# Altium schematic sheet alarmlight_v1_0.SchDoc: AlarmLight ControlBoard
size A4; DrawnBy: cddxcdx; DocumentNumber: 2018*********; Revision: V1.0; SheetNumber: 1; SheetTotal: 1
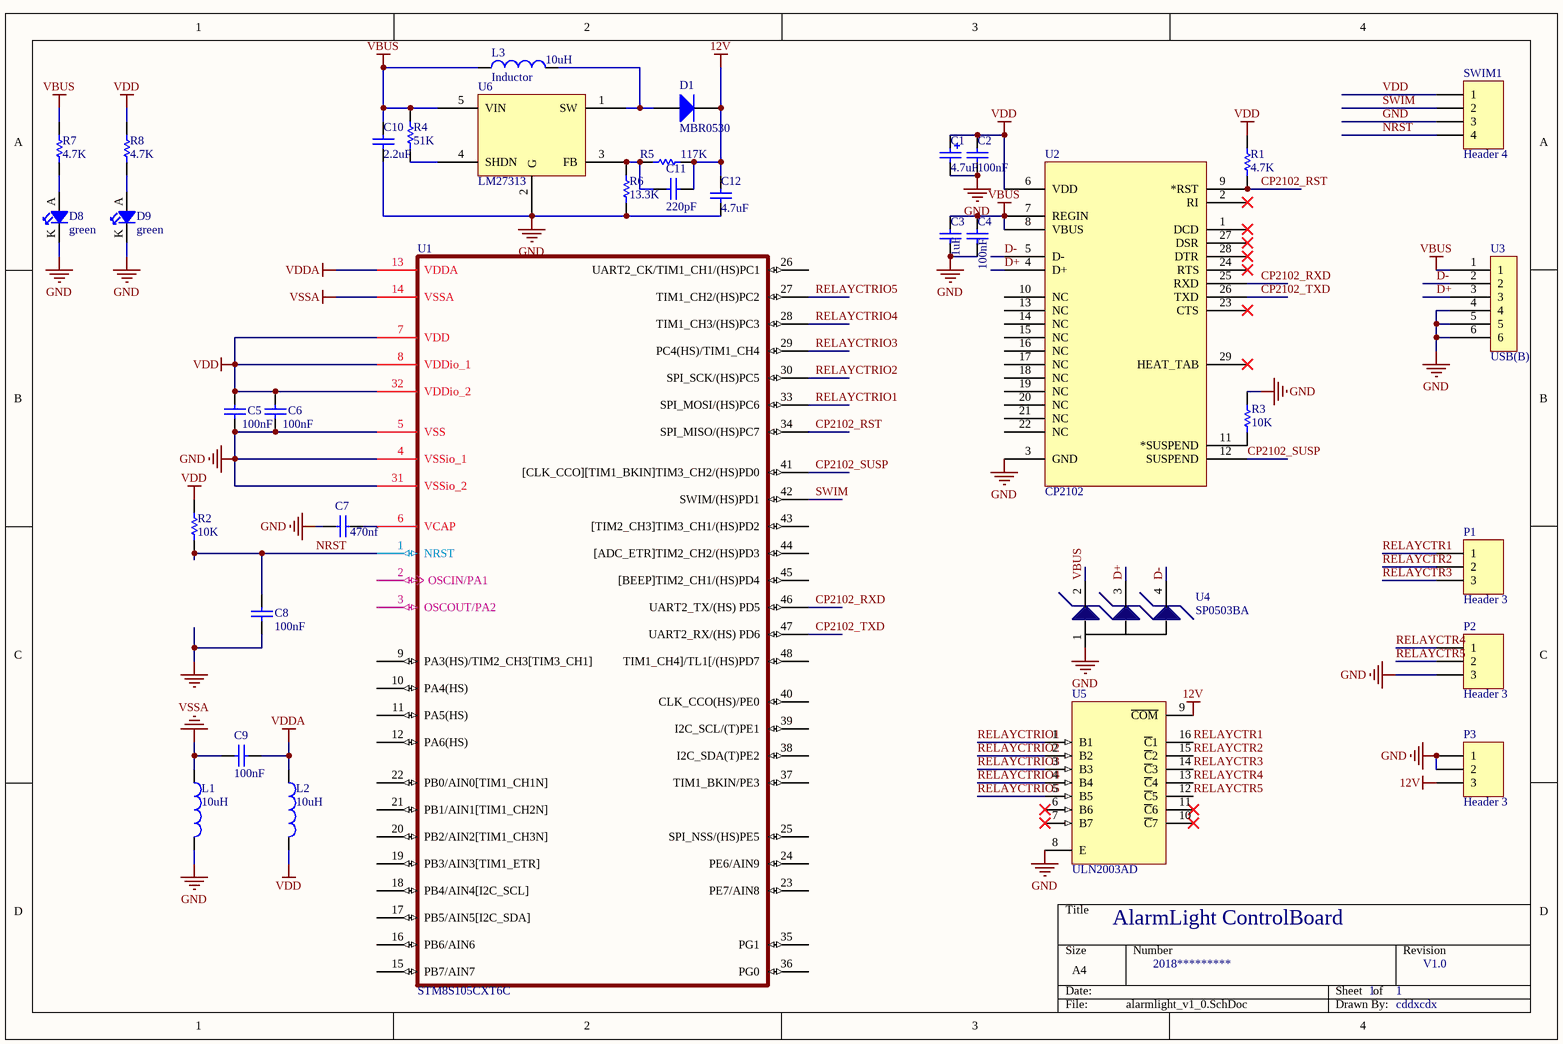
[diagram p0: alarmlight_v1_0.SchDoc]

## Parts
C1  4.7uF  [TC3216]
C2  100nF  [0805C]
C3  1uF  [0805C]
C4  100nF  [0805C]
C5  100nF  [0805C]
C6  100nF  [0805C]
C7  value 470nf  [0805C]  (hidden comment: Cap)
C8  100nF  [0805C]
C9  100nF  [0805C]
C10  2.2uF  [0805C]
C11  220pF  [0805C]
C12  4.7uF  [C-6032]
D1  MBR0530  [SOD_123]
D8  value green  [Diode-LED-0805]  (hidden comment: LED-3mm)
D9  value green  [Diode-LED-0805]  (hidden comment: LED-3mm)
L1  value 10uH  [0805R]  (hidden comment: Inductor)
L2  value 10uH  [0805R]  (hidden comment: Inductor)
L3  Inductor  value 10uH  [SWPA3012]
P1  Header 3  [HDR1X3]
P2  Header 3  [HDR1X3]
P3  Header 3  [HDR1X3]
R1  4.7K  [0805R]
R2  10K  [0805R]
R3  10K  [0805R]
R4  51K  [0805R]
R5  117K  [0805R]
R6  13.3K  [0805R]
R7  4.7K  [0805R]
R8  4.7K  [0805R]
SWIM1  Header 4  [HDR1X4]
U1  STM8S105CXT6C  [LQFP48]
U2  CP2102  [QFN28N5X5-0p5P]
U3  USB(B)  [USB2.5-2H4D]
U4  SP0503BA  [SOT143]
U5  ULN2003AD  [D016_N]
U6  LM27313  [SOT-23-5]

## Nets
12V: C11.1 C12.2 D1.2(K) P3.3 R5.1 U5.9(~{COM})
GND: C1.2 C2.1 C3.1 C4.1 C5.1 C6.1 C7.1 C8.1 C10.1 C12.1 D8.K D9.K L1.2 P2.3 P3.1 P3.2 R3.1 R6.1 SWIM1.3 U1.4(VSSio_1) U1.5(VSS) U1.31(VSSio_2) U2.3(GND) U3.4 U3.5 U3.6 U4.1 U5.8(E) U6.2(G)
VBUS: C3.2 C4.2 C10.2 L3.1 R4.2 R7.2 U2.7(REGIN) U2.8(VBUS) U3.1 U4.2 U6.5(VIN)
VDD: C1.1 C2.2 C5.2 C6.2 L2.2 R1.2 R2.2 R8.2 SWIM1.1 U1.7(VDD) U1.8(VDDio_1) U1.32(VDDio_2) U2.6(VDD)
VDDA: C9.2 L2.1 U1.13(VDDA)
VSSA: C9.1 L1.1 U1.14(VSSA)
CP2102_RST: R1.1 U1.34(SPI_MISO/(HS)PC7) U2.9(*RST)
CP2102_RXD: U1.46(UART2_TX/(HS)_PD5) U2.25(RXD)
CP2102_SUSP: U1.41([CLK_CCO][TIM1_BKIN]TIM3_CH2/(HS)PD0) U2.12(SUSPEND)
CP2102_TXD: U1.47(UART2_RX/(HS)_PD6) U2.26(TXD)
D+: U2.4(D+) U3.3 U4.3
D-: U2.5(D-) U3.2 U4.4
NRST: C8.2 R2.1 SWIM1.4 U1.1(NRST)
RELAYCTR1: P1.1 U5.16(~{C}1)
RELAYCTR2: P1.2 U5.15(~{C}2)
RELAYCTR3: P1.3 U5.14(~{C}3)
RELAYCTR4: P2.1 U5.13(~{C}4)
RELAYCTR5: P2.2 U5.12(~{C}5)
RELAYCTRIO1: U1.33(SPI_MOSI/(HS)PC6) U5.1(B1)
RELAYCTRIO2: U1.30(SPI_SCK/(HS)PC5) U5.2(B2)
RELAYCTRIO3: U1.29(PC4(HS)/TIM1_CH4) U5.3(B3)
RELAYCTRIO4: U1.28(TIM1_CH3/(HS)PC3) U5.4(B4)
RELAYCTRIO5: U1.27(TIM1_CH2/(HS)PC2) U5.5(B5)
SWIM: SWIM1.2 U1.42(SWIM/(HS)PD1)
NetC7_2: C7.2 U1.6(VCAP)
NetC11_2: C11.2 R5.2 R6.2 U6.3(FB)
NetD1_1: D1.1(A) L3.2 U6.1(SW)
NetD8_A: D8.A R7.1
NetD9_A: D9.A R8.1
NetR3_2: R3.2 U2.11(*SUSPEND)
NetR4_1: R4.1 U6.4(SHDN)

Not connected (* = marked no-connect by the designer): U1 2(OSCIN/PA1) 3(OSCOUT/PA2) 9(PA3(HS)/TIM2_CH3[TIM3_CH1]) 10(PA4(HS)) 11(PA5(HS)) 12(PA6(HS)) 15(PB7/AIN7) 16(PB6/AIN6) 17(PB5/AIN5[I2C_SDA]) 18(PB4/AIN4[I2C_SCL]) 19(PB3/AIN3[TIM1_ETR]) 20(PB2/AIN2[TIM1_CH3N]) 21(PB1/AIN1[TIM1_CH2N]) 22(PB0/AIN0[TIM1_CH1N]) 23(PE7/AIN8) 24(PE6/AIN9) 25(SPI_NSS/(HS)PE5) 26(UART2_CK/TIM1_CH1/(HS)PC1) 35(PG1) 36(PG0) 37(TIM1_BKIN/PE3) 38(I2C_SDA(T)PE2) 39(I2C_SCL/(T)PE1) 40(CLK_CCO(HS)/PE0) 43([TIM2_CH3]TIM3_CH1/(HS)PD2) 44([ADC_ETR]TIM2_CH2/(HS)PD3) 45([BEEP]TIM2_CH1/(HS)PD4) 48(TIM1_CH4]/TL1[/(HS)PD7); U2 1(DCD)* 2(RI)* 10(NC) 13(NC) 14(NC) 15(NC) 16(NC) 17(NC) 18(NC) 19(NC) 20(NC) 21(NC) 22(NC) 23(CTS)* 24(RTS)* 27(DSR)* 28(DTR)* 29(HEAT_TAB)*; U5 6(B6)* 7(B7)* 10(~{C}7)* 11(~{C}6)*

## Library data of the parts
C1 = Cap Pol1_4: Polarized Capacitor (Radial); Value: 10uF; Published: 8-Jun-2000; Revision: July-2002: Re-released for DXP Platform.; Publisher: Altium Limited
C2-C6 C8-C12 = CAP: Capacitor; Value: 100pF; Published: 8-Jun-2000; Revision: July-2002: Re-released for DXP Platform.; Publisher: Altium Limited
C7 = Cap: Capacitor; Published: 8-Jun-2000; LatestRevisionDate: 17-Jul-2002; LatestRevisionNote: Re-released for DXP Platform.; PackageReference: RAD-0.3; Publisher: Altium Limited
D1 = Diode: Default Diode; Published: 8-Jun-2000; LatestRevisionDate: 17-Jul-2002; LatestRevisionNote: Re-released for DXP Platform.; PackageVersion: Sep-1996; PackageReference: SMC; Publisher: Altium Limited; PackageDescription: DO-214-AB/SMC; 2 C-Bend Leads; Body 7.9 x 5.9 mm, inc. leads (LxW); Code_JEDEC: DO-214-AB
D8 D9 = Diode-LED-1210
L1-L3 = Inductor: Code_IEC: 1005; Published: 8-Jun-2000; PackageReference: 0402-A; Publisher: Altium Limited; Code_JEITA: 0402
  L1 L2: LatestRevisionDate: 17-Jul-2002; LatestRevisionNote: Re-released for DXP Platform.
  L3: LatestRevisionDate: 29-May-2009; LatestRevisionNote: IPC-7351 Footprint Added.; PackageDescription: Chip Inductor
P1-P3 = Header 3: Header, 3-Pin; LatestRevisionDate: 17-Jul-2002; LatestRevisionNote: Re-released for DXP Platform.; Publisher: Altium Limited
R1-R8 = res1: Resistor; Value: 1K; Published: 8-Jun-2000; Revision: July-2002: Re-released for DXP Platform.; Publisher: Altium Limited
SWIM1 = Header 4: Header, 4-Pin; LatestRevisionDate: 17-Jul-2002; LatestRevisionNote: Re-released for DXP Platform.; Publisher: Altium Limited
U1 = STM8S105C4T6C: ST 8-bit  Microcontroller
U2 = CP2102: Imported; PART DESC: SINGLE-CHIP USB TO UART BRIDGE, QFN28, RoHS.; MFG #1: SILICON LABS; PART NUMBER: CP2102; Value: Value; RefDes: RefDes; Type: DEV
U5 = ULN2003AD: Darlington Transistor Array; Published: 15-May-2002; LatestRevisionDate: 13-Apr-2006; LatestRevisionNote: IPC-7351 Footprint Added.; DatasheetVersion: Sep-1986; PackageVersion: Jan-1998; PackageReference: D016; Publisher: Altium Limited; PackageDescription: 16-Pin Small Outline Integrated Circuit 1.27 mm Pitch; Code_IPC: SOIC127P600-16; ComponentLink1Description: Manufacturer Link; ComponentLink1URL: http://www.ti.com/; ComponentLink2Description: Datasheet; ComponentLink2URL: http://www-s.ti.com/sc/ds/uln2002a.pdf